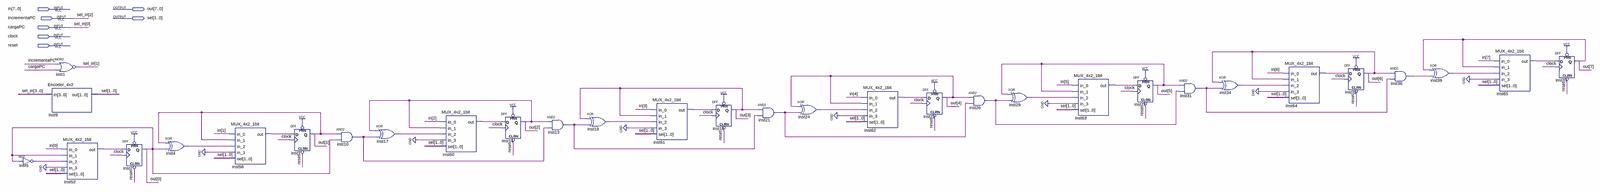
[diagram p0: schematic sheet, whole]
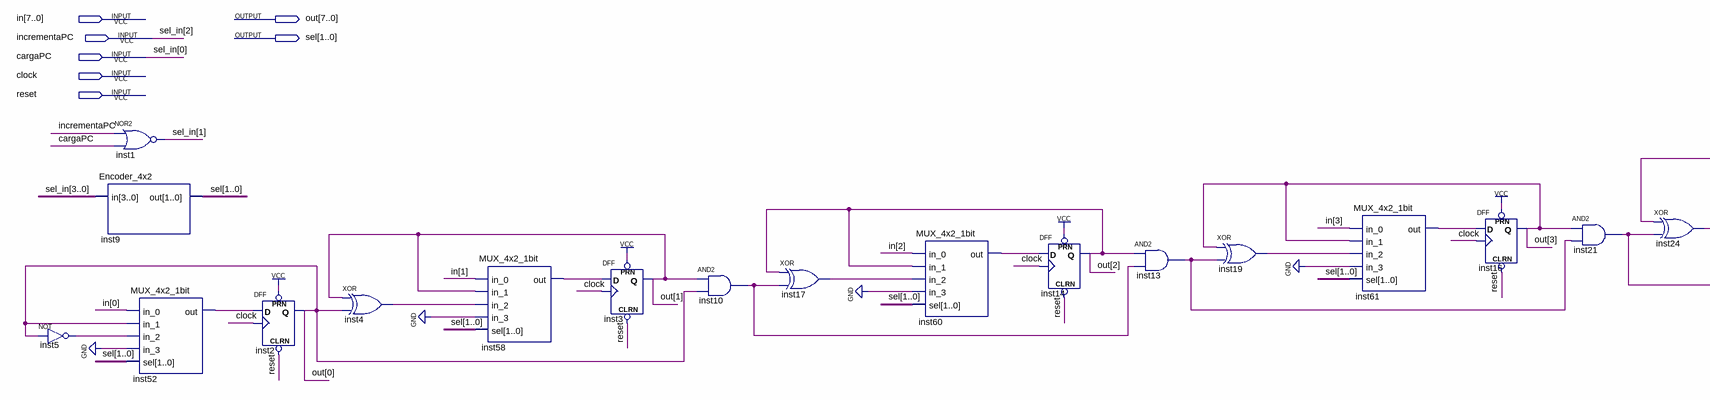
[diagram p1: schematic sheet, left part]
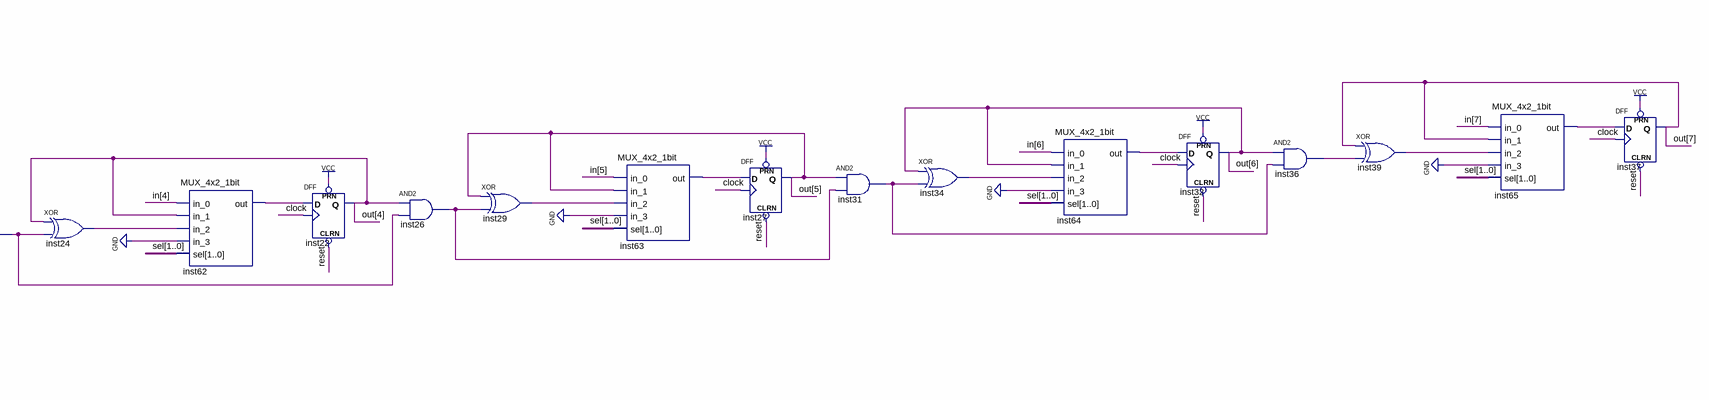
[diagram p2: schematic sheet, right part]
// Quartus schematic ProgramCounter.bdf as structural Verilog: 32 symbols, 7 pins
module ProgramCounter (
  input  [7:0] in,
  input  incrementaPC,
  input  cargaPC,
  input  clock,
  input  reset,
  output [7:0] out,
  output [1:0] sel
);

  wire inst4_out, inst5_out, inst10_out, inst13_out, inst17_out, inst19_out, inst21_out, inst24_out,
       inst26_out, inst29_out, inst31_out, inst34_out, inst36_out, inst39_out, inst52_out, inst58_out,
       inst60_out, inst61_out, inst62_out, inst63_out, inst64_out, inst65_out;
  wire [3:1] sel_in;

  not inst5 (inst5_out, out[0]);
  Encoder_4x2 inst9 (.in({sel_in[3], incrementaPC, sel_in[1], cargaPC}), .out(sel));
  nor inst1 (sel_in[1], incrementaPC, cargaPC);
  MUX_4x2_1bit inst52 (.in_0(in[0]), .in_1(out[0]), .in_2(inst5_out), .in_3(1'b0), .sel(sel), .out(inst52_out));
  DFF inst2 (.CLRN(reset), .CLK(clock), .D(inst52_out), .PRN(1'b1), .Q(out[0]));
  xor inst4 (inst4_out, out[1], out[0]);
  MUX_4x2_1bit inst58 (.in_0(in[1]), .in_1(out[1]), .in_2(inst4_out), .in_3(1'b0), .sel(sel), .out(inst58_out));
  DFF inst3 (.CLRN(reset), .CLK(clock), .D(inst58_out), .PRN(1'b1), .Q(out[1]));
  and inst10 (inst10_out, out[1], out[0]);
  xor inst17 (inst17_out, out[2], inst10_out);
  MUX_4x2_1bit inst60 (.in_0(in[2]), .in_1(out[2]), .in_2(inst17_out), .in_3(1'b0), .sel(sel), .out(inst60_out));
  DFF inst14 (.CLRN(reset), .CLK(clock), .D(inst60_out), .PRN(1'b1), .Q(out[2]));
  and inst13 (inst13_out, out[2], inst10_out);
  xor inst19 (inst19_out, out[3], inst13_out);
  MUX_4x2_1bit inst61 (.in_0(in[3]), .in_1(out[3]), .in_2(inst19_out), .in_3(1'b0), .sel(sel), .out(inst61_out));
  DFF inst16 (.CLRN(reset), .CLK(clock), .D(inst61_out), .PRN(1'b1), .Q(out[3]));
  and inst21 (inst21_out, out[3], inst13_out);
  xor inst24 (inst24_out, out[4], inst21_out);
  MUX_4x2_1bit inst62 (.in_0(in[4]), .in_1(out[4]), .in_2(inst24_out), .in_3(1'b0), .sel(sel), .out(inst62_out));
  DFF inst22 (.CLRN(reset), .CLK(clock), .D(inst62_out), .PRN(1'b1), .Q(out[4]));
  and inst26 (inst26_out, out[4], inst21_out);
  xor inst29 (inst29_out, out[5], inst26_out);
  MUX_4x2_1bit inst63 (.in_0(in[5]), .in_1(out[5]), .in_2(inst29_out), .in_3(1'b0), .sel(sel), .out(inst63_out));
  DFF inst27 (.CLRN(reset), .CLK(clock), .D(inst63_out), .PRN(1'b1), .Q(out[5]));
  and inst31 (inst31_out, out[5], inst26_out);
  xor inst34 (inst34_out, out[6], inst31_out);
  MUX_4x2_1bit inst64 (.in_0(in[6]), .in_1(out[6]), .in_2(inst34_out), .in_3(1'b0), .sel(sel), .out(inst64_out));
  DFF inst32 (.CLRN(reset), .CLK(clock), .D(inst64_out), .PRN(1'b1), .Q(out[6]));
  and inst36 (inst36_out, out[6], inst31_out);
  xor inst39 (inst39_out, out[7], inst36_out);
  MUX_4x2_1bit inst65 (.in_0(in[7]), .in_1(out[7]), .in_2(inst39_out), .in_3(1'b0), .sel(sel), .out(inst65_out));
  DFF inst37 (.CLRN(reset), .CLK(clock), .D(inst65_out), .PRN(1'b1), .Q(out[7]));

  // Other names for the same wires on the sheet: sel_in (some bits) = {incrementaPC, cargaPC}
endmodule
